# EAGLE design Adafruit ADS1115 ADC STEMMA QT (EAGLE 9.6.2)
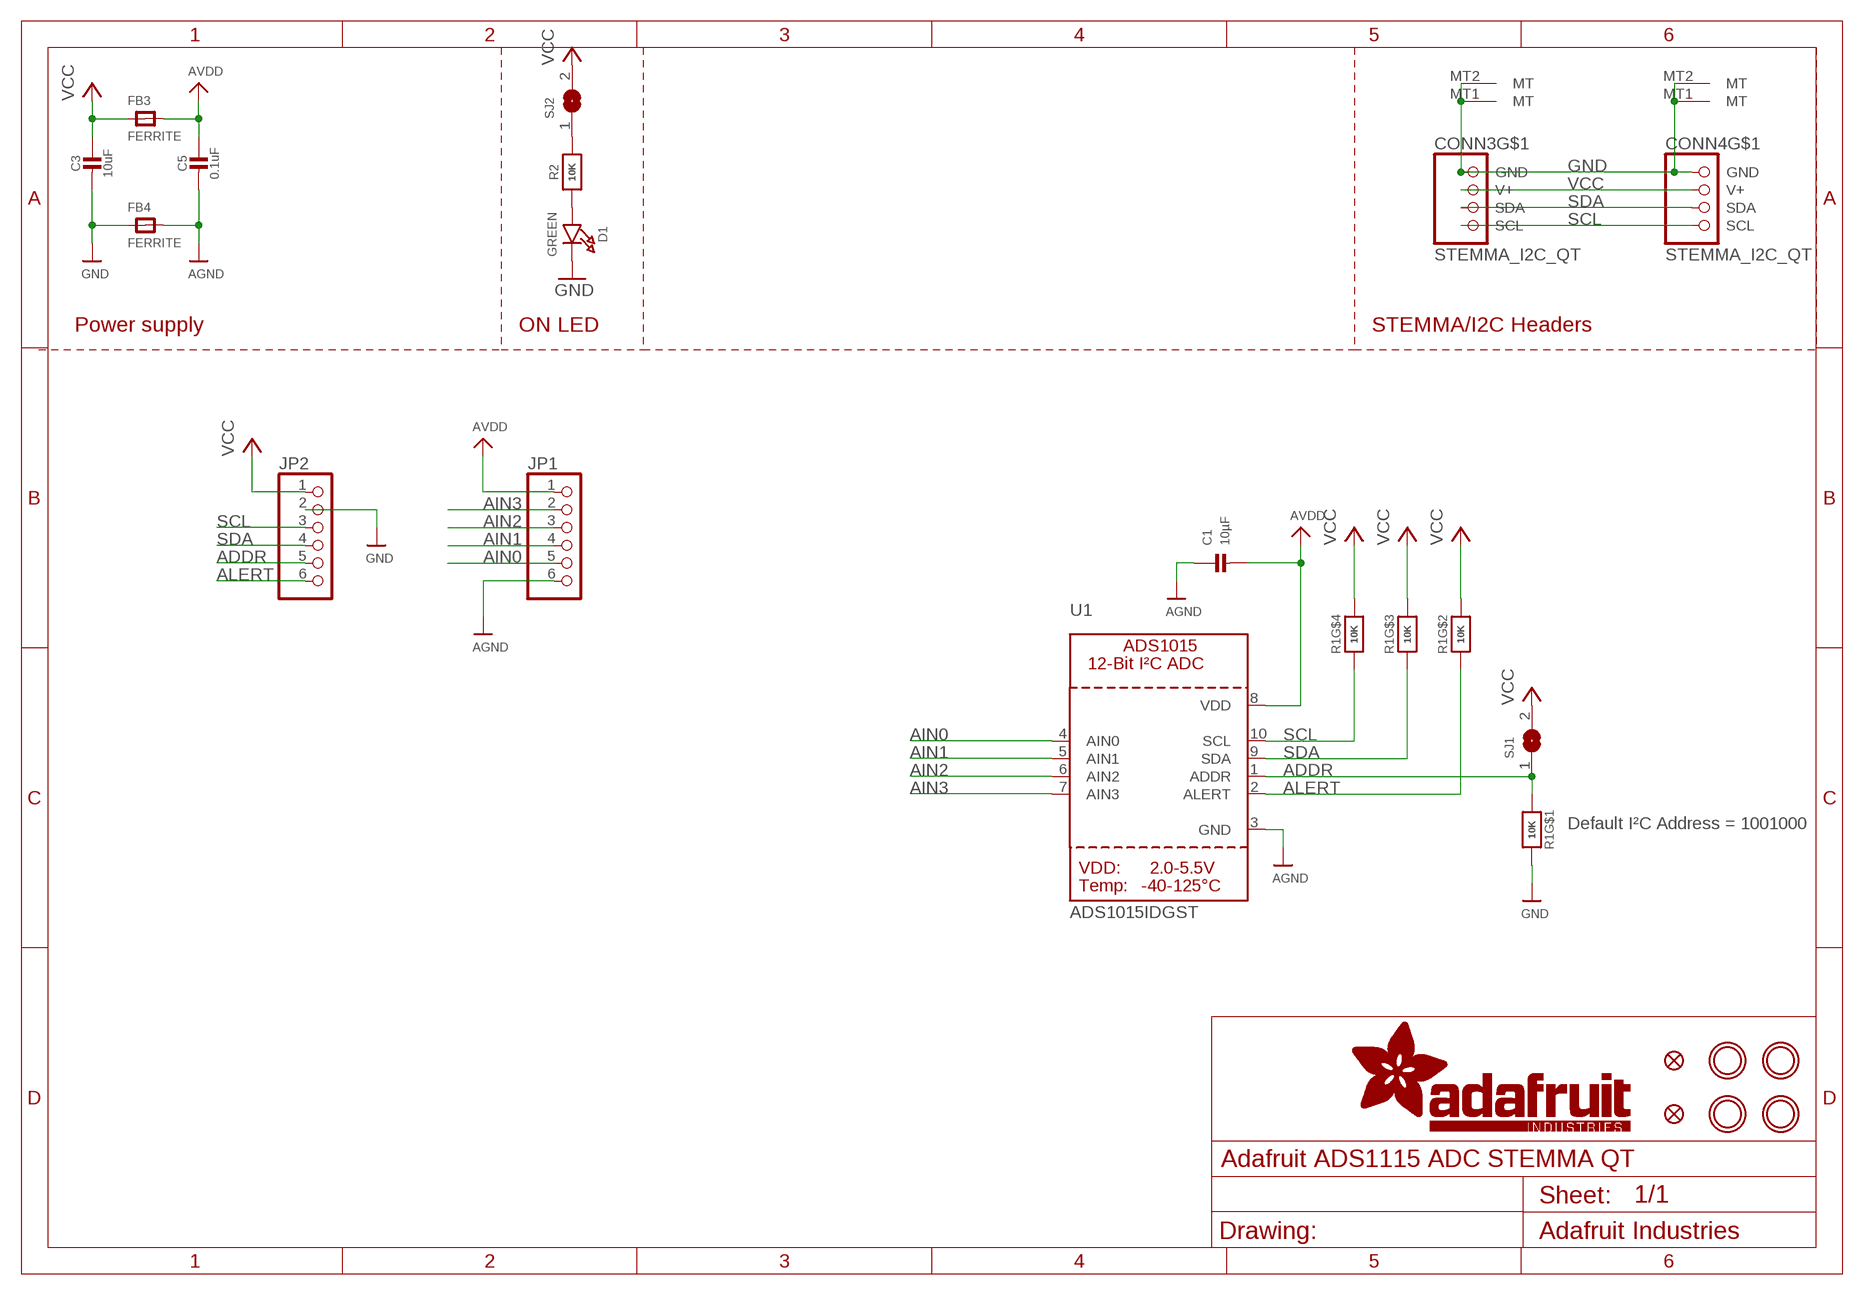
[diagram p0: schematic, sheet 1]

## Parts
C1  10µF  CAP_CERAMIC0805-NOOUTLINE  [0805-NO]
C3  10uF  CAP_CERAMIC0805-NOOUTLINE  [0805-NO]
C5  0.1uF  CAP_CERAMIC0603_NO  [0603-NO]
CONN3  STEMMA_I2C_QT  [JST_SH4]
CONN4  STEMMA_I2C_QT  [JST_SH4]
D1  GREEN  LED0603_NOOUTLINE  [CHIPLED_0603_NOOUTLINE]
FB3  FERRITE  FERRITE-0603NO  [0603-NO]
FB4  FERRITE  FERRITE-0603NO  [0603-NO]
FID3  FIDUCIAL_1MM  [FIDUCIAL_1MM]
FID4  FIDUCIAL_1MM  [FIDUCIAL_1MM]
JP1  HEADER-1X670MIL  [1X06_ROUND_70]
JP2  HEADER-1X670MIL  [1X06_ROUND_70]
R1  10K  RESISTOR_4PACK  [RESPACK_4X0603]
R2  10K  RESISTOR_0603_NOOUT  [0603-NO]
SJ1  SOLDERJUMPER  [SOLDERJUMPER_ARROW_NOPASTE]
SJ2  SOLDERJUMPERCLOSED  [SOLDERJUMPER_CLOSEDWIRE]
U1  ADS1015IDGST  ADC_ADS1015  [MSOP10]
U$25  MOUNTINGHOLE2.5  [MOUNTINGHOLE_2.5_PLATED]
U$27  MOUNTINGHOLE2.5  [MOUNTINGHOLE_2.5_PLATED]
U$29  MOUNTINGHOLE2.5  [MOUNTINGHOLE_2.5_PLATED]
U$30  MOUNTINGHOLE2.5  [MOUNTINGHOLE_2.5_PLATED]

## Nets
ADDR: JP2.5 R1.1 SJ1.1 U1.1(ADDR)
AGND: C1.1 C5.2 FB4.2 JP1.6 U1.3(GND)
AIN0: JP1.5 U1.4(AIN0)
AIN1: JP1.4 U1.5(AIN1)
AIN2: JP1.3 U1.6(AIN2)
AIN3: JP1.2 U1.7(AIN3)
ALERT: JP2.6 R1.2 U1.2(ALERT)
AVDD: C1.2 C5.1 FB3.2 JP1.1 U1.8(VDD)
GND: C3.2 CONN3.1(GND) CONN3.MT1(MT) CONN3.MT2(MT) CONN4.1(GND) CONN4.MT1(MT) CONN4.MT2(MT) D1.C FB4.1 JP2.2 R1.8
N$1 [highpower]: R2.2 SJ2.1
N$3: D1.A R2.1
SCL: CONN3.4(SCL) CONN4.4(SCL) JP2.3 R1.4 U1.10(SCL)
SDA: CONN3.3(SDA) CONN4.3(SDA) JP2.4 R1.3 U1.9(SDA)
VCC [highpower]: C3.1 CONN3.2(V+) CONN4.2(V+) FB3.1 JP2.1 R1.5 R1.6 R1.7 SJ1.2 SJ2.2

## Notes on the sheet
- Power supply | ON LED | STEMMA/I2C Headers
- Default I²C Address = 1001000

## Library data of the parts
C1 C3 C5 = microbuilder:CAP_CERAMIC: Ceramic Capacitors For new designs, use the packages preceded by an '_' character since they are more reliable: The following footprints should be used on most boards: _0402 - Standard footprint for regular board layouts _0603 - Standard footprint for regular board layouts _0805 - Standard footprint for regular board layouts _1206 - Standard footprint for regular board layouts For extremely tight-pitch boards where space is at a premium, the following 'micro-pitch' footprints can be used (smaller pads, no silkscreen outline, etc.): _0402MP - Micro-pitch footprint for very dense/compact boards _0603MP - Micro-pitch footprint for very dense/compact boards _0805MP - Micro-pitch footprint for very dense/compact boards _1206MP - Micro-pitch footprint for very dense/compact boards
CONN3 CONN4 = microbuilder:STEMMA_I2C
D1 = microbuilder:LED: LED 0603 - 0603 Surface Mount Package 2mA: Green LED - Low Power (3.9mcd, 2ma, 1.7Vf) - Digikey: 475-2709-2-ND Orange LED - Low Power (9.8mcd, 2ma, 1.8Vf) - Digikey: 475-1194-2-ND Red LED - Low Power (5mcd, 2ma, 1.8Vf) - Digikey: 475-1195-2-ND Yellow LED - Low Power (7mcd, 2ma, 1.8Vf) - Digikey: 475-1196-2-ND 5mA: Blue LED - Low Power (17mcd, 5ma, 2.9Vf) - Digikey: LNJ937W8CRACT-ND 0805 - 0805 Surface Mount Package 2mA: Red LED (8.8mcd, 2mA, 1.8Vf, Clear) - Low Power [Digikey: 475-2510-1-ND] Green LED (5mcd, 2mA, 1.8Vf, Clear) - Low Power [Digikey: 475-2730-1-ND] Yellow LED (11.3mcd, 2mA, 1.8Vf, Clear) - Low Power [Digikey: 475-2555-1-ND] 20mA: Red LED (104mcd, 20mA, Diffused) - LS R976 [Digikey: 475-1278-6-ND] Red LED (12mcd, 20mA, 2.0Vf, Clear) - APT2012EC [Digikey: 754-1128-1-ND] Green LED (15mcd, 20mA, 2.2Vf, Clear) - APT2012GC [Digikey: 754-1131-1-ND] Orange LED (160mcd, 20mA, 2.1Vf, Clear) - APT2012SECK [Digikey: 754-1130-1-ND] 1206 - 1206 Surface Mount Package Green LED (26mcd, 20mA, Diffused) - LG N971 [Digikey: 475-1407-6-ND] Red LED (15mcd, 20mA, Diffused) - LH N974 [Digikey: 475-1416-6-ND] Cree - Cree High-Power Surface Mount LEDs XPEBWT-L1-0000-00D50 - White 111lm 350mA 2.9Vf 6200K 110° XTEAWT-00-0000-00000LEE3 - White 114lm 350mA 2.85Vf 5000K 115° Everlight - Everlight 45-21 Series Surface Mount LEDs 45-21/QK2C-B2832AC2CB2/2T - Warm White 2000mcd 20mA 3.25Vf 3050K 120° 45-21/LK2C-B38452C4CB2/2T - Nuetral White 2000mcd 20mA 3.25Vf 4150K 120° 45-21/LK2C-B50634C6CB2/2T - Cold White 2200mcd 20mA 3.25Vf 5650K 120° PLCC2 Reverse Mount LS T77K-J1L2-1-0-2-R18-Z - Red 11.25mcd 2mA 1.8Vf 630nm 120° LO T77K-L1M2-24-Z - Orange 19.6mcd 2mA 1.8Vf 606nm 120° LY T77K-K2M1-26-Z - Yellow 15.7mcd 2mA 1.8Vf 587nm 120°
FB3 FB4 = microbuilder:FERRITE: Ferrite Bead 0603 MMZ1608B121C - 120 Ohm @ 100MHz, 600mA, 0.15 Ohm DC Resistance - Digikey: 445-2164-1-ND BK1608HW121-T - 120 Ohm, 600mA Ferrite Chip - Digikey: 587-1876-2-ND 0805 HZ0805B272R-10 - 2.7K Ohm @ 100MHz, 200mA, 0.8 Ohm DC Resistance - Digikey: 240-2504-1-ND (see also Murata BLM21BD272SN1L) MMZ2012Y152B - 1.5K Ohm @ 100MHz, 500mA, 0.4 Ohm DC Resistance - Digikey: 445-1560-1-ND - Mainly for high frequency (80-400MHz) MMZ2012R102A - 1K Ohm @ 100MHz, 500mA, 0.3 Ohm DC Resistance - Digikey: 445-1555-2-ND - More general purpose (10-200MHz)
FID3 FID4 = microbuilder:FIDUCIAL: Fiducial Alignment Points Various fiducial points for machine vision alignment.; BOM: EXCLUDE
JP1 JP2 = microbuilder:HEADER-1X6: PIN HEADER
R1 = microbuilder:RESISTOR_4PACK: Resistor Packs (4 resistors) 4 x 0603 10K 1/16W - Digikey: YC164J-10KCT-ND
R2 = microbuilder:RESISTOR: Resistors For new designs, use the packages preceded by an '_' character since they are more reliable: The following footprints should be used on most boards: _0402 - Standard footprint for regular board layouts _0603 - Standard footprint for regular board layouts _0805 - Standard footprint for regular board layouts _1206 - Standard footprint for regular board layouts For extremely tight-pitch boards where space is at a premium, the following 'micro-pitch' footprints can be used (smaller pads, no silkscreen outline, etc.): _0402MP - Micro-pitch footprint for very dense/compact boards _0603MP - Micro-pitch footprint for very dense/compact boards _0805MP - Micro-pitch footprint for very dense/compact boards _1206MP - Micro-pitch footprint for very dense/compact boards
SJ1 = microbuilder:SOLDERJUMPER: SMD Solder JUMPER Solder the two pads together to create a connection, or remove the solder to break it. REFLOW - Use this footprint for solder paste and reflow ovens. WAVE - Use this footprint for hand-soldering (larger pads). CLOSED - Has a trace between the two pads to ensure it is closed by default. The trace needs to be cut to disable the jumper, and can be closed again by creating a solder bridge between the two pads.; BOM: EXCLUDE
SJ2 = microbuilder:SOLDERJUMPER: SMD Solder JUMPER Solder the two pads together to create a connection, or remove the solder to break it. REFLOW - Use this footprint for solder paste and reflow ovens. WAVE - Use this footprint for hand-soldering (larger pads). CLOSED - Has a trace between the two pads to ensure it is closed by default. The trace needs to be cut to disable the jumper, and can be closed again by creating a solder bridge between the two pads.
U1 = microbuilder:ADC_ADS1015: ADS1015 - 12-bit 4-Channel I2C ADC with Internal PGA VDD: 2.0-5.5V Sampling Rate: 3.3ksps Gain Settings: 2/3, 1, 2, 4, 8, 16 I2C Address: ADDR low = 1001000x, ADDR high = 1001001x Internal Comparator The ADS1015 includes an internal comparator that can be set to output a high-level on ALERT when the conversion results exceeeds a pre-defined upper level, and will deassert itself when the level falls below a pre-defined lower threshold level. It can also be set to windowed mode where the ALERT pin will be asserted if the data exceeds the upper threshold or falls below the lower threshold.
U$25 U$27 U$29 U$30 = microbuilder:MOUNTINGHOLE: Mounting Hole For #2 screws (0.086"/2.18mm width, 0.094"/2.4mm hole) use 2.5mm; BOM: EXCLUDE

## Net classes
1 highpower: width 0.305 mm, drill 0.483 mm
2 lowpower: width 0.254 mm, drill 0.483 mm

## Board
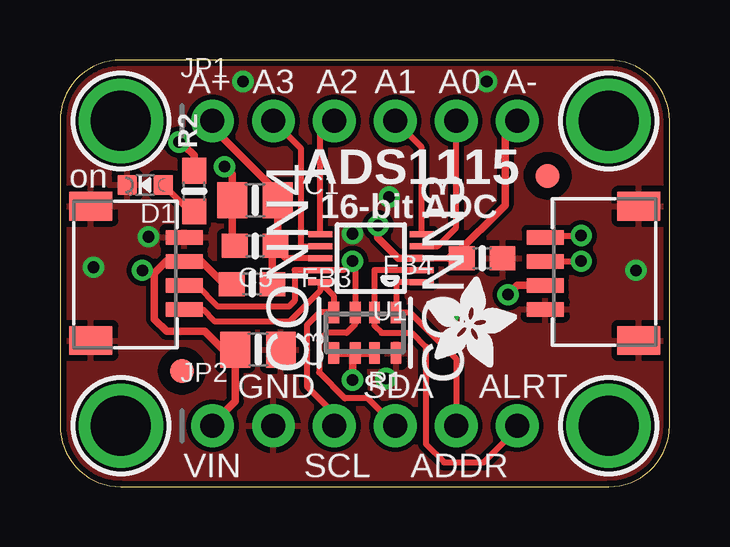
[diagram p1: board, top side]
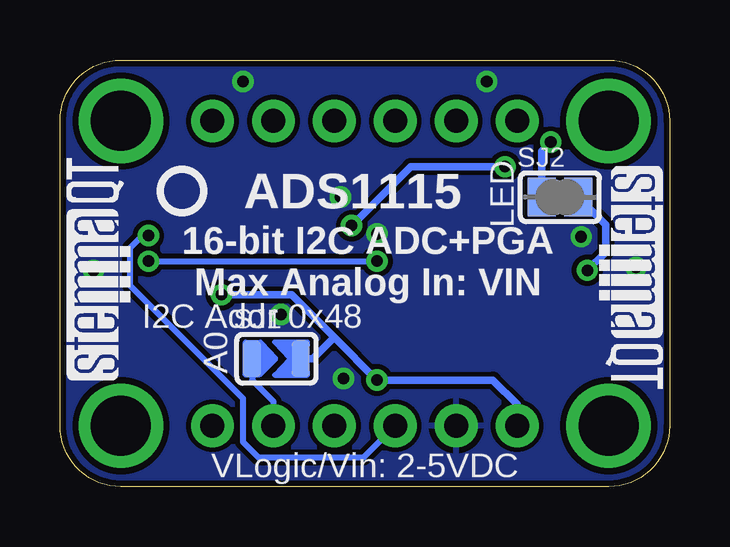
[diagram p2: board, bottom side, seen from below]

Size 25.4 x 17.78 mm. Coordinates in mm from the lower left corner, seen from the top.
Outline: 0,15.24 0,2.54 arc90 2.54,0 22.86,0 arc90 25.4,2.54 25.4,15.24 arc90 22.86,17.78 2.54,17.78 arc90 0,15.24
Copper layers (1*16): Top 0.035mm / dielectric 1.5mm / Bottom 0.035mm
Design rules "adafruit 7-7": minimum track width 6mil, minimum drill 15.5mil, track to track 8mil, track to pad 7mil, pad to pad 7mil, via to via 7mil, smd to smd 7mil, copper to edge 10mil, drill to drill 8mil, minimum pad ring 10mil, minimum via ring 8mil, stop-mask expansion 2mil, vias tented up to drill 20mil, thermal gap 10mil

### Footprints (pad centres in the part's own frame; a part is rotated, then mirrored left to right if it is on the bottom)
0805-NO = smd 1.24 x 1.5: 1 -0.95,0; 2 0.95,0
0603-NO = smd 1.075 x 1: 1 -0.85,0; 2 0.85,0
JST_SH4 = smd 0.6 x 1.55: 1 -1.5,2.514; 2 -0.5,2.514; 3 0.5,2.514; 4 1.5,2.514 | smd 1.2 x 1.8: MT1 -2.8,-1.386; MT2 2.8,-1.386
CHIPLED_0603_NOOUTLINE = smd 0.8 x 0.8: A 0,-0.75; C 0,0.75
FIDUCIAL_1MM = smd 1 x 1: 1 0,0
1X06_ROUND_70 = drill 1 pad 1.778: 1 -6.35,0; 2 -3.81,0; 3 -1.27,0; 4 1.27,0; 5 3.81,0; 6 6.35,0
RESPACK_4X0603 = smd 0.45 x 0.9: 1 -1.3,-0.85; 2 -0.4,-0.85; 3 0.4,-0.85; 4 1.3,-0.85; 5 1.3,0.85; 6 0.4,0.85; 7 -0.4,0.85; 8 -1.3,0.85
SOLDERJUMPER_ARROW_NOPASTE = smd 0.762 x 1.524: 1 -1.016,0; 2 1.016,0
SOLDERJUMPER_CLOSEDWIRE = smd 1.168 x 1.6: 1 -0.762,0; 2 0.762,0 | smd 0.635 x 0.203: WIRE 0,0
MSOP10 = smd 0.25 x 1: 1 -1,-2.113; 2 -0.5,-2.113; 3 0,-2.113; 4 0.5,-2.113; 5 1,-2.113; 6 1,2.113; 7 0.5,2.113; 8 0,2.113; 9 -0.5,2.113; 10 -1,2.113
MOUNTINGHOLE_2.5_PLATED = drill 2.5 pad 3.2: P$1 0,0

### Placement (x,y rotation side)
C1  8.13,11.94 0 top
C3  8.26,5.71 0 top
C5  8.13,10.03 180 top
CONN3  22.73,8.89 90 top
CONN4  2.67,8.89 270 top
D1  3.56,12.57 90 top
FB3  8,8.45 0 top
FB4  17.59,9.53 180 top
FID3  5.08,4.83 0 top
FID4  20.32,12.95 0 top
JP1  12.7,15.24 0 top
JP2  12.7,2.54 0 top
R1  12.7,6.41 180 top
R2  5.59,12.32 90 top
SJ1  16.38,5.33 0 bottom
SJ2  4.57,12.06 0 bottom
U1  12.95,9.53 90 top
U$25  2.54,15.24 0 top
U$27  22.86,15.24 0 top
U$29  2.54,2.54 0 top
U$30  22.86,2.54 0 top
U$32  [ADAFRUIT_3.5MM]  15.24,4.95 0 top
U$33  [PCBFEAT-REV-040]  20.32,12.32 0 bottom
U$34  [STEMMAQT]  22.48,4.45 90 bottom
U$35  [STEMMAQT]  2.92,13.34 270 bottom

### Tracks (layer width: path | path; a pad name or v marks a point on that pad's centre or on a via)
ADDR
  Top 0.254: U1.1 14,8.53 R1.1 14.58,7.26 16.51,5.33 JP2.5
  Bottom 0.254: SJ1.1 17.4,4.45 16.51,3.56 JP2.5
AGND  (via drill 0.48)
  Top 0.254: U1.3 16.21,9.53 | 16.34,9.65 16.43,9.62 FB4.2
  Top 0.305: C5.2 7.18,10.13 C1.1 7.18,13.02 v6.86,13.34 | JP1.6 18.54,14.73 18.54,11.73 16.43,9.62 | 16.34,9.65 16.21,9.53 | v13.25,10.88 13.25,10.37 14.1,9.53 U1.3
  Bottom 0.305: v6.86,13.34 10.79,13.34 v13.25,10.88
AIN0
  Top 0.254: U1.4 15.74,10.03 16.51,10.79 JP1.5
AIN1
  Top 0.254: U1.5 15.07,14.14 JP1.4
AIN2
  Top 0.254: U1.6 10.84,14.65 JP1.3
AIN3
  Top 0.254: JP1.2 10.03,14.1 10.03,10.03 U1.7
ALERT
  Top 0.254: U1.2 13.1,9.03 R1.2 13.1,6.71 13.4,6.41 14.67,6.41 15.24,5.84 15.24,1.78 16,1.02 17.65,1.02 19.05,2.41 JP2.6
AVDD
  Top 0.254: U1.8 9.38,9.53 8.98,9.93 C5.1
  Top 0.305: FB3.2 8.85,9.91 C5.1 9.08,10.13 C1.2 9.08,12.26 6.35,14.99 JP1.1
GND  (via drill 0.48)
  other vias: 13.59,4.51 24,9.02 1.4,9.14 3.68,10.41 12.19,10.54 13.72,12.06 16.19,7.18 7.62,16.89 17.78,16.89
  pour Top: 0,17.78 25.4,17.78 25.4,0 0,0
  pour Bottom: 0,17.78 25.4,17.78 25.4,0 0,0
N$1  (via drill 0.48)
  Top 0.305: R2.2 5.59,13.8 5.21,14.19 5.12,14.19 v4.95,14.36
  Bottom 0.305: SJ2.1 5.33,13.98 v4.95,14.36
N$3
  Top 0.254: D1.A 5.59,11.29 R2.1
SCL  (via drill 0.48)
  Top 0.254: CONN4.4 5.94,7.39 6.45,6.88 9.56,6.88 10.84,8.16 U1.10 11.4,7.97 R1.4 10.82,7.26 10.29,6.73 10.29,4.19 11.43,3.05 JP2.3 | CONN3.4 20.29,10.46 v21.72,10.46
  Bottom 0.254: v21.72,10.46 21.97,10.46 22.48,9.96 22.48,8.38 17.78,3.68 17.78,1.87 17.13,1.22 12.75,1.22 JP2.3
SDA  (via drill 0.48)
  Top 0.254: JP2.4 12.83,3.68 11.87,3.68 10.79,4.76 10.79,6.1 11.11,6.41 11.94,6.41 12.3,6.78 R1.3 12.3,9.29 v12.19,9.4 11.82,9.03 U1.9 9.78,9.03 9.78,7.75 9.53,7.5 6.58,7.5 5.69,8.39 CONN4.3 | CONN3.3 21.71,9.39 v21.72,9.4
  Bottom 0.254: v21.72,9.4 v12.19,9.4
VCC  (via drill 0.48)
  Top 0.305: JP2.1 6.35,2.6 7.3,3.56 C3.1 6.8,5.71 6.04,6.48 4.45,6.48 3.94,6.99 3.94,8.89 | R1.5 R1.6 | R1.6 R1.7 | FB3.1 6.83,8.45 5.89,9.39 CONN4.2 4.44,9.39 3.94,8.89 | R1.6 12.19,5.46 v12.19,4.45 | CONN3.2 19.06,8.39 v18.67,8 | v3.43,9.02 3.56,8.89 3.94,8.89
  Bottom 0.305: JP2.1 6.35,3.43 7.37,4.45 v12.19,4.45 13.97,6.22 | v18.67,8 15.75,8 13.97,6.22 | SJ1.2 14.86,5.33 13.97,6.22 | SJ2.2 2.67,10.92 2.67,9.78 v3.43,9.02

### Text on the board
tPlace: A+ | A3 | A2 | A1 | A0 | A- | ADS1115 | on | 16-bit ADC | GND | SDA | ALRT | VIN | SCL | ADDR
bPlace: LED | ADS1115 | 16-bit I2C ADC+PGA / Max Analog In: VIN | I2C Addr 0x48 | A0 | VLogic/Vin: 2-5VDC